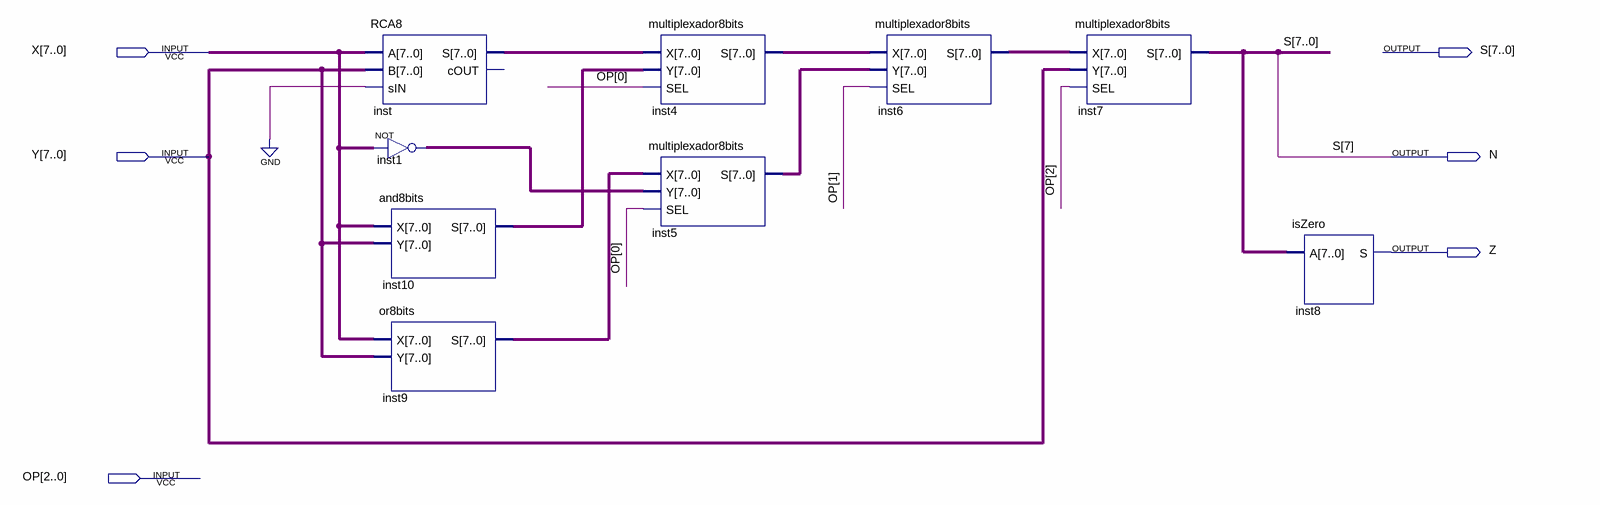
[diagram p0: schematic sheet]
// Quartus schematic ULA8bits.bdf as structural Verilog: 9 symbols, 6 pins
module ULA8bits (
  input  [7:0] X,
  input  [7:0] Y,
  input  [2:0] OP,
  output [7:0] S,
  output N,
  output Z
);

  wire [7:0] inst1_out, inst4_s, inst5_s, inst6_s, inst9_s, inst10_s, inst_s;

  RCA8 inst (.A(X), .B(Y), .sIN(1'b0), .S(inst_s));  // open: cOUT
  assign inst1_out = ~X;  // NOT inst1, 8 bits wide
  and8bits inst10 (.X(X), .Y(Y), .S(inst10_s));
  or8bits inst9 (.X(X), .Y(Y), .S(inst9_s));
  multiplexador8bits inst4 (.X(inst_s), .Y(inst10_s), .SEL(OP[0]), .S(inst4_s));
  multiplexador8bits inst5 (.X(inst9_s), .Y(inst1_out), .SEL(OP[0]), .S(inst5_s));
  multiplexador8bits inst6 (.X(inst4_s), .Y(inst5_s), .SEL(OP[1]), .S(inst6_s));
  multiplexador8bits inst7 (.X(inst6_s), .Y(Y), .SEL(OP[2]), .S({N, S[6:0]}));
  isZero inst8 (.A({N, S[6:0]}), .S(Z));

  assign S[7] = N;
endmodule
